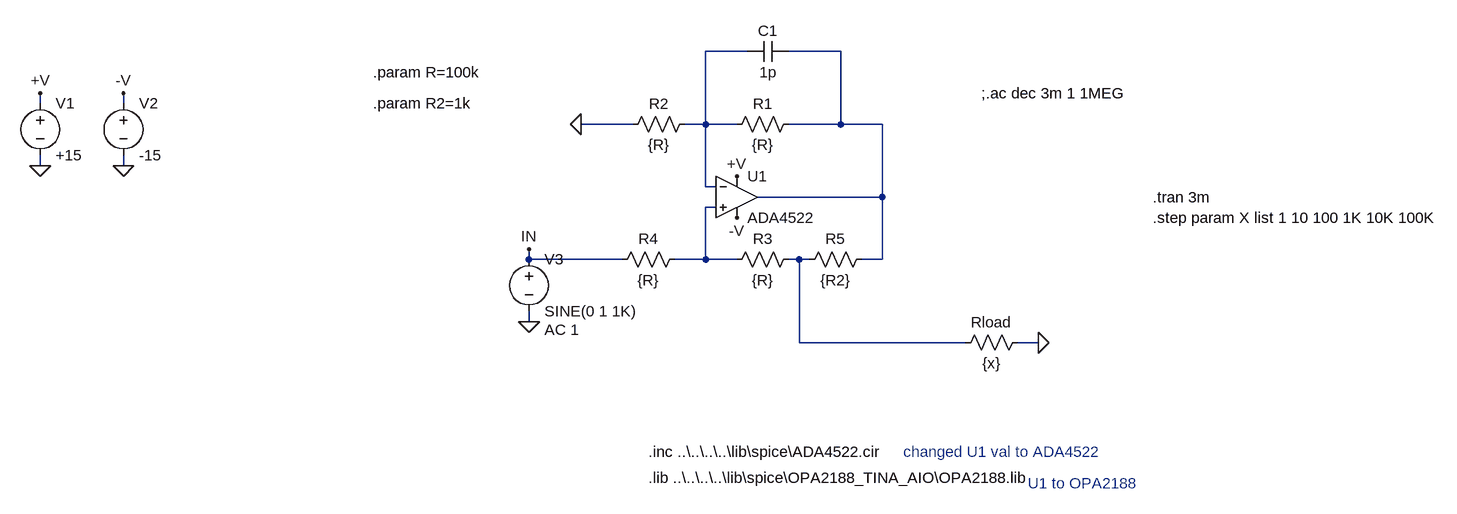
[diagram p0: schematic Howland_Improved.asc]
Howland_Improved.asc, the LTspice schematic file:
Version 4
SHEET 1 1280 728
WIRE 208 48 144 48
WIRE 352 48 272 48
WIRE -880 128 -880 112
WIRE -752 128 -752 112
WIRE 32 160 -48 160
WIRE 144 160 144 48
WIRE 144 160 112 160
WIRE 192 160 144 160
WIRE 352 160 352 48
WIRE 352 160 272 160
WIRE 416 160 352 160
WIRE -880 224 -880 208
WIRE -752 224 -752 208
WIRE 144 256 144 160
WIRE 160 256 144 256
WIRE 416 272 416 160
WIRE 416 272 224 272
WIRE 160 288 144 288
WIRE -128 368 -128 352
WIRE 16 368 -128 368
WIRE 144 368 144 288
WIRE 144 368 96 368
WIRE 192 368 144 368
WIRE 288 368 272 368
WIRE 304 368 288 368
WIRE 416 368 416 272
WIRE 416 368 384 368
WIRE -128 464 -128 448
WIRE 288 496 288 368
WIRE 544 496 288 496
WIRE 656 496 624 496
FLAG -752 224 0
FLAG -880 224 0
FLAG 192 240 +V
FLAG -880 112 +V
FLAG -752 112 -V
FLAG 192 304 -V
FLAG -128 464 0
FLAG -128 352 IN
FLAG 656 496 0
FLAG -48 160 0
SYMBOL voltage -880 112 R0
SYMATTR InstName V1
SYMATTR Value +15
SYMBOL voltage -752 112 R0
SYMATTR InstName V2
SYMATTR Value -15
SYMBOL res 288 144 R90
WINDOW 0 0 56 VBottom 2
WINDOW 3 32 56 VTop 2
SYMATTR InstName R1
SYMATTR Value {R}
SYMBOL res 128 144 R90
WINDOW 0 0 56 VBottom 2
WINDOW 3 32 56 VTop 2
SYMATTR InstName R2
SYMATTR Value {R}
SYMBOL voltage -128 352 R0
WINDOW 123 24 124 Left 2
WINDOW 39 0 0 Left 2
SYMATTR Value2 AC 1
SYMATTR InstName V3
SYMATTR Value SINE(0 1 1K)
SYMBOL res 288 352 R90
WINDOW 0 0 56 VBottom 2
WINDOW 3 32 56 VTop 2
SYMATTR InstName R3
SYMATTR Value {R}
SYMBOL res 112 352 R90
WINDOW 0 0 56 VBottom 2
WINDOW 3 32 56 VTop 2
SYMATTR InstName R4
SYMATTR Value {R}
SYMBOL res 528 512 R270
WINDOW 0 32 56 VTop 2
WINDOW 3 0 56 VBottom 2
SYMATTR InstName Rload
SYMATTR Value {x}
SYMBOL res 400 352 R90
WINDOW 0 0 56 VBottom 2
WINDOW 3 32 56 VTop 2
SYMATTR InstName R5
SYMATTR Value {R2}
SYMBOL Opamps\\opamp2 192 208 R0
SYMATTR InstName U1
SYMATTR Value ADA4522
SYMBOL cap 272 32 R90
WINDOW 0 0 32 VBottom 2
WINDOW 3 32 32 VTop 2
SYMATTR InstName C1
SYMATTR Value 1p
TEXT 832 272 Left 2 !.tran 3m
TEXT 832 304 Left 2 !.step param X list 1 10 100 1K 10K 100K
TEXT -368 80 Left 2 !.param R=100k
TEXT -368 128 Left 2 !.param R2=1k
TEXT 56 664 Left 2 !.inc ..\\..\\..\\..\\lib\\spice\\ADA4522.cir
TEXT 568 112 Left 2 !;.ac dec 3m 1 1MEG
TEXT 56 704 Left 2 !.lib ..\\..\\..\\..\\lib\\spice\\OPA2188_TINA_AIO\\OPA2188.lib
TEXT 448 664 Left 2 ;changed U1 val to ADA4522
TEXT 640 712 Left 2 ;U1 to OPA2188

The netlist it stands for:
* Howland_Improved.asc
V1 +V 0 +15
V2 -V 0 -15
R1 N002 N001 {R}
R2 N001 0 {R}
V3 IN 0 SINE(0 1 1K) AC 1
R3 N004 N003 {R}
R4 N003 IN {R}
Rload N004 0 {x}
R5 N002 N004 {R2}
XU1 N003 N001 +V -V N002 ADA4522  ; pins In+ In- V+ V- OUT
C1 N002 N001 1p
.tran 3m
.step param X list 1 10 100 1K 10K 100K
.param R=100k
.param R2=1k
.inc ..\..\..\..\lib\spice\ADA4522.cir
;.ac dec 3m 1 1MEG
.lib ..\..\..\..\lib\spice\OPA2188_TINA_AIO\OPA2188.lib
* changed U1 val to ADA4522
* U1 to OPA2188
.backanno
.end